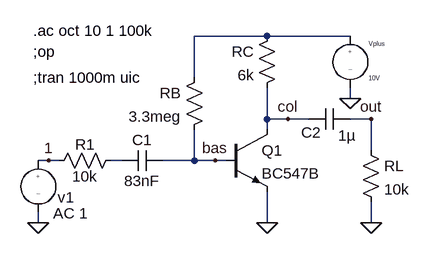
[diagram p0: schematic q1-verst-2.asc]
q1-verst-2.asc, the LTspice schematic file:
Version 4
SHEET 1 880 680
WIRE 176 -16 64 -16
WIRE 304 -16 176 -16
WIRE 64 48 64 -16
WIRE 304 80 304 64
WIRE 176 112 176 64
WIRE 208 112 176 112
WIRE 240 112 208 112
WIRE 336 112 304 112
WIRE 176 128 176 112
WIRE 336 160 336 112
WIRE -160 176 -176 176
WIRE -144 176 -160 176
WIRE -48 176 -64 176
WIRE 64 176 64 128
WIRE 64 176 16 176
WIRE 96 176 64 176
WIRE 112 176 96 176
WIRE -176 272 -176 256
WIRE 176 272 176 224
WIRE 336 272 336 240
FLAG 176 272 0
FLAG 304 80 0
FLAG 96 176 bas
FLAG 208 112 col
FLAG -176 272 0
FLAG -160 176 1
FLAG 336 272 0
FLAG 336 112 out
SYMBOL EIT_Semiconductors\\npn 112 128 R0
SYMATTR InstName Q1
SYMATTR Value BC547B
SYMBOL source-V 304 -32 R0
SYMATTR InstName Vplus
SYMATTR Value 10V
SYMBOL source-V -176 160 R0
WINDOW 123 23 97 Left 2
WINDOW 39 0 0 Left 2
WINDOW 0 30 73 Left 2
WINDOW 3 29 108 Left 2
SYMATTR Value2 AC 1
SYMATTR InstName v1
SYMATTR Value ""
SYMBOL res 192 -32 M0
SYMATTR InstName RC
SYMATTR Value 6k
SYMBOL cap -48 192 R270
WINDOW 0 32 32 VTop 2
WINDOW 3 0 32 VBottom 2
SYMATTR InstName C1
SYMATTR Value 83nF
SYMBOL res 80 32 M0
SYMATTR InstName RB
SYMATTR Value 3.3meg
SYMBOL res -160 192 R270
WINDOW 0 25 56 VTop 2
WINDOW 3 7 56 VBottom 2
SYMATTR InstName R1
SYMATTR Value 10k
SYMBOL cap 240 128 R270
WINDOW 0 -20 4 VTop 2
WINDOW 3 6 59 VBottom 2
SYMATTR InstName C2
SYMATTR Value 1µ
SYMBOL res 320 144 R0
SYMATTR InstName RL
SYMATTR Value 10k
TEXT -184 8 Left 2 !;op
TEXT -184 48 Left 2 !;tran 1000m uic
TEXT -184 -24 Left 2 !.ac oct 10 1 100k

The netlist it stands for:
* q1-verst-2.asc
Q1 col bas 0 0 BC547B
Vplus N001 0 10V
v1 1 0 AC 1
RC N001 col 6k
C1 N002 bas 83nF
RB N001 bas 3.3meg
R1 1 N002 10k
C2 col out 1µ
RL out 0 10k
.model NPN NPN
.model PNP PNP
.lib standard.bjt
;op
;tran 1000m uic
.ac oct 10 1 100k
.backanno
.end